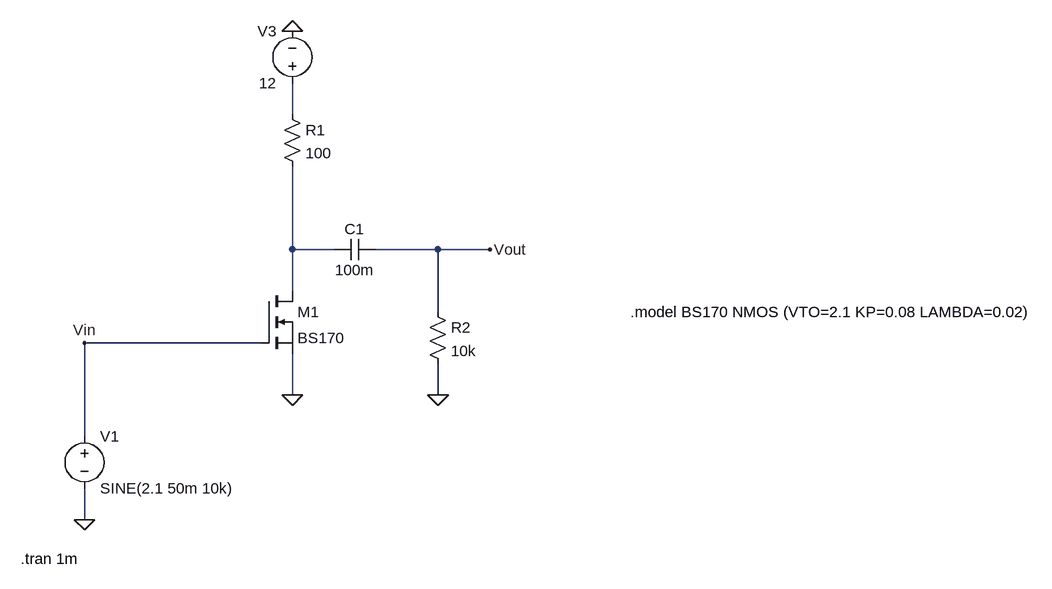
[diagram p0: schematic Draft65.asc]
Draft65.asc, the LTspice schematic file:
Version 4
SHEET 1 2428 680
WIRE 400 -336 400 -384
WIRE 400 -128 400 -256
WIRE 464 -128 400 -128
WIRE 624 -128 528 -128
WIRE 704 -128 624 -128
WIRE 400 -64 400 -128
WIRE 624 -32 624 -128
WIRE 352 16 80 16
WIRE 400 96 400 32
WIRE 624 96 624 48
WIRE 80 160 80 16
WIRE 80 288 80 240
FLAG 624 96 0
FLAG 400 96 0
FLAG 80 288 0
FLAG 400 -464 0
FLAG 704 -128 Vout
FLAG 80 16 Vin
SYMBOL voltage 80 144 R0
WINDOW 123 0 0 Left 0
WINDOW 39 0 0 Left 0
SYMATTR InstName V1
SYMATTR Value SINE(2.1 50m 10k)
SYMBOL res 384 -352 R0
SYMATTR InstName R1
SYMATTR Value 100
SYMBOL res 608 -48 R0
SYMATTR InstName R2
SYMATTR Value 10k
SYMBOL nmos 352 -64 R0
SYMATTR InstName M1
SYMATTR Value BS170
SYMBOL cap 528 -144 R90
WINDOW 0 0 32 VBottom 2
WINDOW 3 32 32 VTop 2
SYMATTR InstName C1
SYMATTR Value 100m
SYMBOL voltage 400 -368 R180
WINDOW 0 24 96 Left 2
WINDOW 3 24 16 Left 2
WINDOW 123 0 0 Left 0
WINDOW 39 0 0 Left 0
SYMATTR InstName V3
SYMATTR Value 12
TEXT -18 348 Left 2 !.tran 1m
TEXT 920 -32 Left 2 !.model BS170 NMOS (VTO=2.1 KP=0.08 LAMBDA=0.02)

The netlist it stands for:
* Draft65.asc
V1 Vin 0 SINE(2.1 50m 10k)
R1 N001 N002 100
R2 Vout 0 10k
M1 N002 Vin 0 0 BS170
C1 Vout N002 100m
V3 N001 0 12
.model NMOS NMOS
.model PMOS PMOS
.lib standard.mos
.tran 1m
.model BS170 NMOS (VTO=2.1 KP=0.08 LAMBDA=0.02)
.backanno
.end